# Altium project ZigBee土壤传感板.PrjPCB
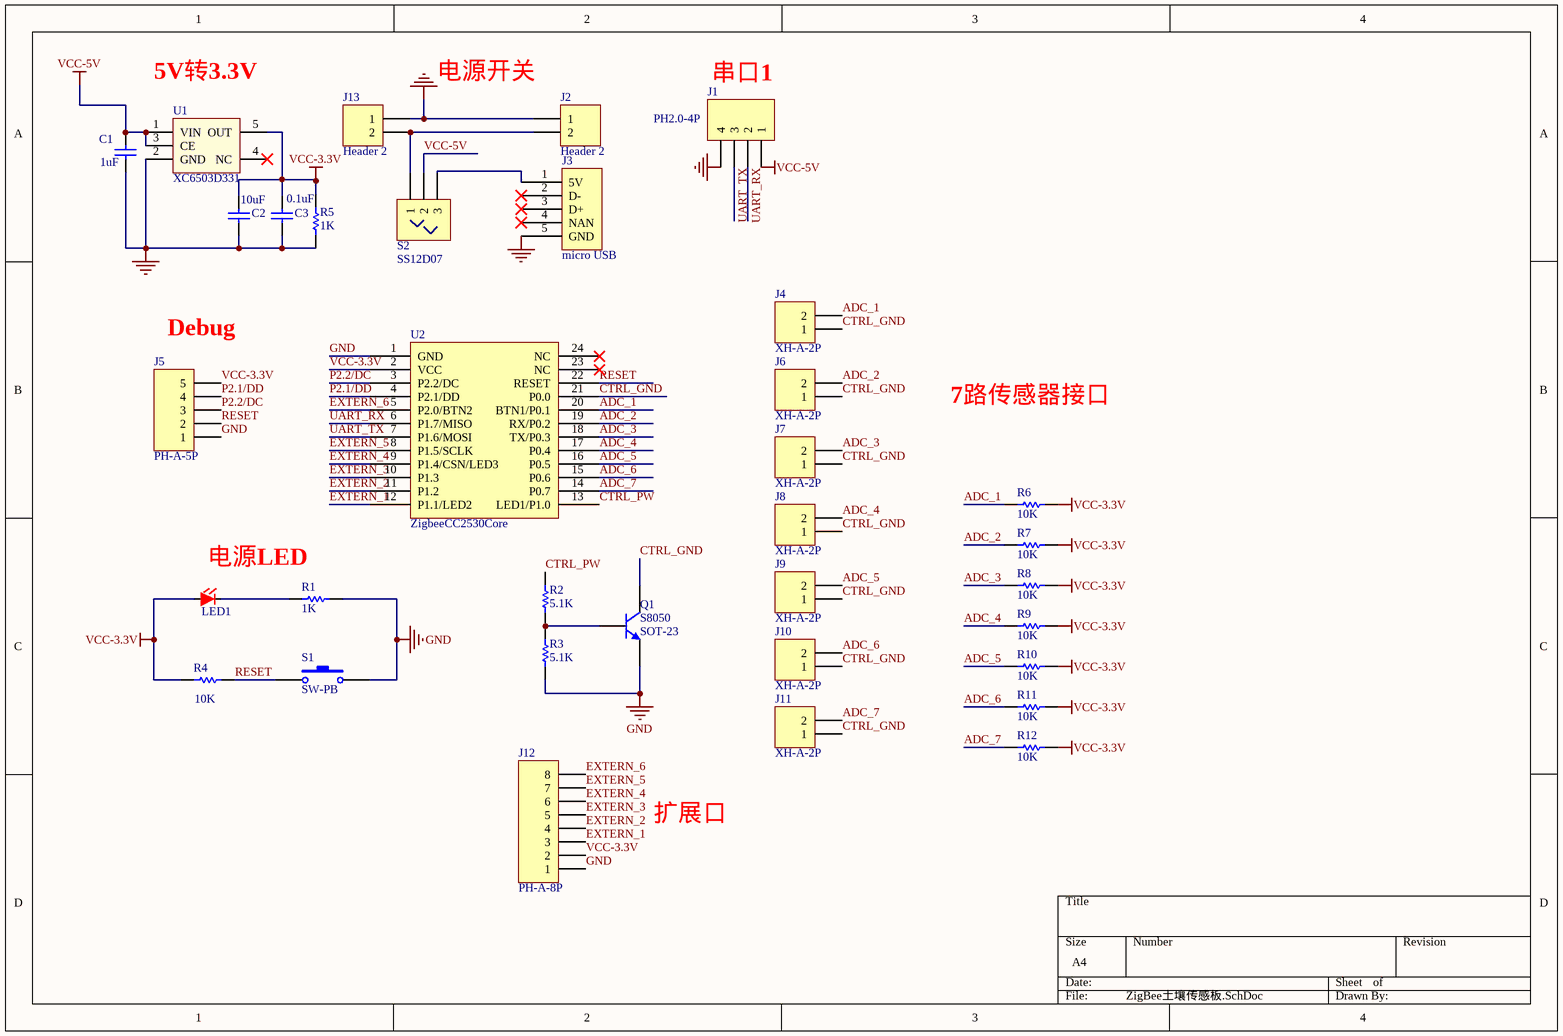
[diagram p0: ZigBee土壤传感板.SchDoc]
1 sheet, 34 parts. Net scope: global (net labels, ports and power ports of the same name join across sheets).
Board file: ZigBee土壤传感板.PcbDoc

## Sheet ZigBee土壤传感板.SchDoc: Zigbee控制板
size A4; Author: 李尧; Revision: V1.0; CurrentDate: 2016年10月11日

### Parts
C1  1uF  [C0805_M2013]
C2  10uF  [C0805_M2013]
C3  0.1uF  [C0805_M2013]
J1  PH2.0-4P  [PH2.0-4P]
J2  Header 2  [18650]
J3  micro USB  [MICRO-USB]
J4  XH-A-2P  [XH-A-2P]
J5  PH-A-5P  [PH-A-5P]
J6  XH-A-2P  [XH-A-2P]
J7  XH-A-2P  [XH-A-2P]
J8  XH-A-2P  [XH-A-2P]
J9  XH-A-2P  [XH-A-2P]
J10  XH-A-2P  [XH-A-2P]
J11  XH-A-2P  [XH-A-2P]
J12  PH-A-8P  [XH-A-8P]
J13  Header 2  [XH-A-2P]
LED1  LED-R  [0805_LED]  (value not drawn)
Q1  SOT-23  value S8050  [SOT-23-3]
R1  value 1K  [R0805_M2013]  (hidden comment: R0805_M2013)
R2  5.1K  [R0805_M2013]
R3  5.1K  [R0805_M2013]
R4  value 10K  [R0805_M2013]  (hidden comment: R0805_M2013)
R5  1K  [R0805_M2013]
R6  10K  [R0805_M2013]
R7  10K  [R0805_M2013]
R8  10K  [R0805_M2013]
R9  10K  [R0805_M2013]
R10  10K  [R0805_M2013]
R11  10K  [R0805_M2013]
R12  10K  [R0805_M2013]
S1  SW-PB  [SW-KEY]
S2  SS12D07  [SS-12D07]
U1  XC6503D331  [SOT23-5]
U2  ZigbeeCC2530Core  [CC2530_CORE]

### Nets
GND: C1.1 C2.2 C3.2 J1.4 J2.1 J3.5(GND) J5.1 J12.1 J13.1 Q1.2(E) R1.2 R3.2 R5.1 S1.2 U1.2(GND) U2.1(GND)
VCC-3.3V: C2.1 C3.1 J5.5 J12.2 LED1.1 R4.1 R5.2 R6.1 R7.1 R8.1 R9.1 R10.1 R11.1 R12.1 U1.5(OUT) U2.2(VCC)
VCC-5V: C1.2 J1.1 S2.2 U1.1(VIN) U1.3(CE)
ADC_1: J4.2 R6.2 U2.20(BTN1/P0.1)
ADC_2: J6.2 R7.2 U2.19(RX/P0.2)
ADC_3: J7.2 R8.2 U2.18(TX/P0.3)
ADC_4: J8.2 R9.2 U2.17(P0.4)
ADC_5: J9.2 R10.2 U2.16(P0.5)
ADC_6: J10.2 R11.2 U2.15(P0.6)
ADC_7: J11.2 R12.2 U2.14(P0.7)
CTRL_GND: J4.1 J6.1 J7.1 J8.1 J9.1 J10.1 J11.1 Q1.3(C) U2.21(P0.0)
CTRL_PW: R2.1 U2.13(LED1/P1.0)
EXTERN_1: J12.3 U2.12(P1.1/LED2)
EXTERN_2: J12.4 U2.11(P1.2)
EXTERN_3: J12.5 U2.10(P1.3)
EXTERN_4: J12.6 U2.9(P1.4/CSN/LED3)
EXTERN_5: J12.7 U2.8(P1.5/SCLK)
EXTERN_6: J12.8 U2.5(P2.0/BTN2)
P2.1/DD: J5.4 U2.4(P2.1/DD)
P2.2/DC: J5.3 U2.3(P2.2/DC)
RESET: J5.2 R4.2 S1.1 U2.22(RESET)
UART_RX: J1.2 U2.6(P1.7/MISO)
UART_TX: J1.3 U2.7(P1.6/MOSI)
NetJ2_2: J2.2 J13.2 S2.1
NetJ3_1: J3.1(5V) S2.3
NetLED1_2: LED1.2 R1.1
NetQ1_1: Q1.1(B) R2.2 R3.1

Not connected (* = marked no-connect by the designer): J3 2(D-)* 3(D+)* 4(NAN)*; U1 4(NC)*; U2 23(NC)* 24(NC)*

### Notes on the sheet
- 5V转3.3V
- 电源开关
- (near J1) 串口1
- (near J5) Debug
- 7路传感器接口
- 电源LED
- 扩展口

### Library data of the parts
C1-C3 = Cap: Capacitor; Published: 8-Jun-2000; LatestRevisionDate: 17-Jul-2002; LatestRevisionNote: Re-released for DXP Platform.; PackageReference: RAD-0.3; Publisher: Altium Limited; PackageDescription: Radial Cap, Thru-Hole; 2 Leads; 0.3 in Pin Spacing
  C1: Value: 1uF
  C2: Value: 10uF
  C3: Value: 0.1uF
J1 = Header 4: Header, 4-Pin; LatestRevisionDate: 17-Jul-2002; LatestRevisionNote: Re-released for DXP Platform.; Publisher: Altium Limited; Value: PH2.0-4P
J2 J13 = Header 2: Header, 2-Pin; LatestRevisionDate: 17-Jul-2002; LatestRevisionNote: Re-released for DXP Platform.; Publisher: Altium Limited
J3 = micro USB: micro USB母
J4 J6-J11 = XH-A-2P: Header, 2.5mm,2-Pin; Value: XH-A-2P
J5 = PH-A-5P: Header, 2.0mm,5-Pin; Value: PH-A-5P
J12 = PH-A-8P: Header, 2.0mm,8-Pin; Value: PH-A-8P
LED1 = LED-R: LED红
Q1 = NPN: NPN Bipolar Transistor; Published: 8-Jun-2000; LatestRevisionDate: 17-Jul-2002; LatestRevisionNote: Re-released for DXP Platform.; PackageReference: TO-226-AA; Publisher: Altium Limited; PackageDescription: TO, Flat Index; 3 In-Line, Axial Leads; Body Dia. 4.8mm; Leads 0.55 x 0.51 mm (max); Code_JEDEC: TO-226-AA
R1 R4 = R0805_M2013: Resistor
R2 R3 R5-R12 = Res1: Resistor; Published: 8-Jun-2000; LatestRevisionDate: 17-Jul-2002; LatestRevisionNote: Re-released for DXP Platform.; PackageReference: AXIAL-0.3; Publisher: Altium Limited; PackageDescription: Axial Device, Thru-Hole; 2 Leads; 0.3 in Pin Spacing
  R2 R3: Value: 5.1K
  R5: Value: 1K
  R6-R12: Value: 10K
S1 = SW-PB: Switch; Published: 24-Mar-1999; LatestRevisionDate: 17-Jul-2002; LatestRevisionNote: Re-released for DXP Platform.; PackageReference: SPST-2; Publisher: Altium Limited; PackageDescription: Switch; 2 Leads
U1 = XC6503Dxxx: Value: XC6503D331
S2 = SS12D07: Value: SS12D07